# EAGLE design bmp_co_spg (EAGLE 9.6.2)
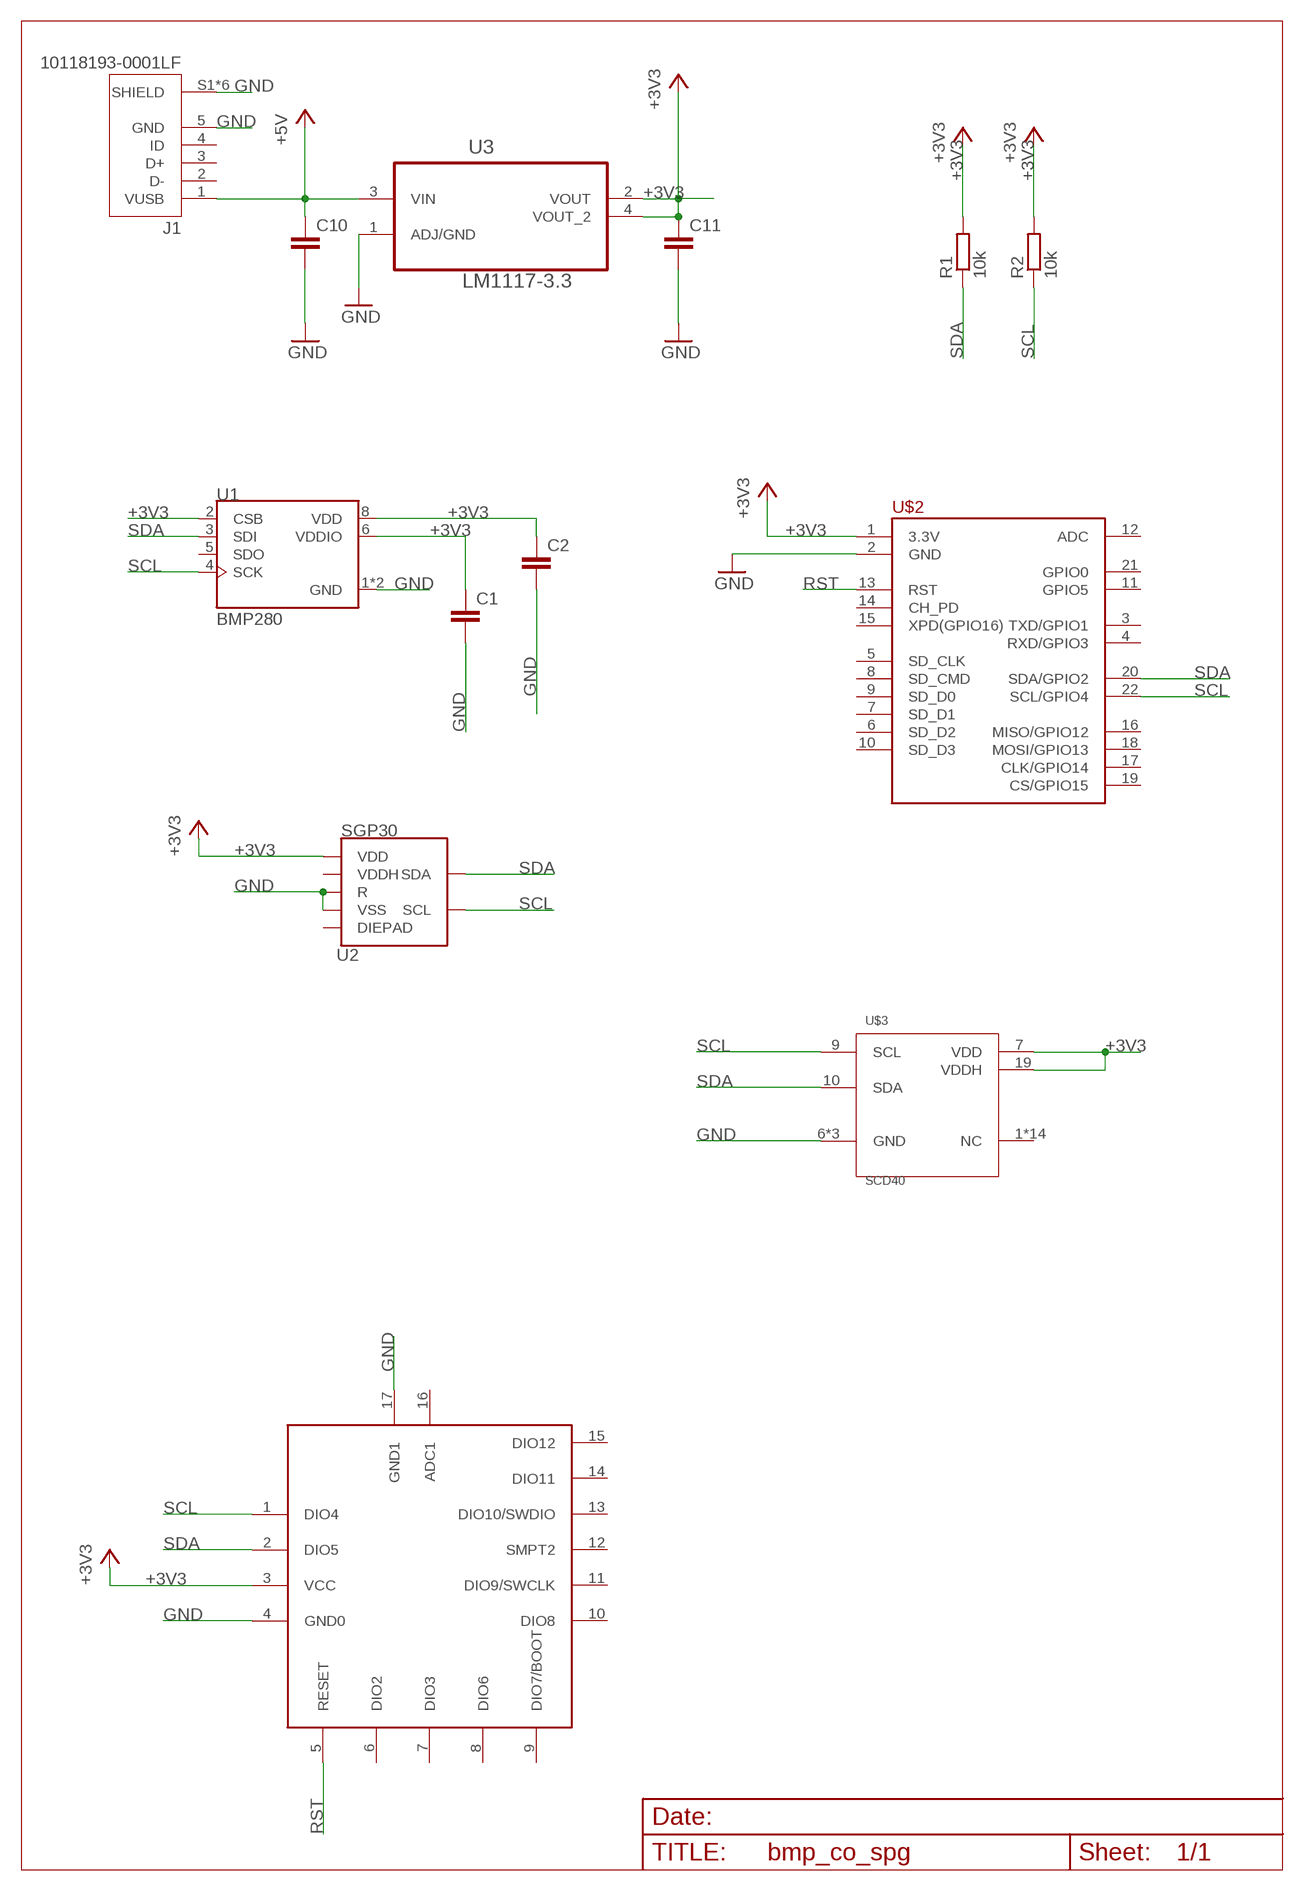
[diagram p0: schematic, sheet 1]

## Parts
C1  100nF  C-EUC1206  [C1206]
C2  100nF  C-EUC1206  [C1206]
C10  47u  C-EUC1206  [C1206]
C11  10u  C-EUC1206  [C1206]
J1  10118193-0001LF  [FCI_10118193-0001LF]
R1  10k  R-EU_R0402  [R0402]
R2  10k  R-EU_R0402  [R0402]
U1  BMP280  [XDCR_BMP280]
U2  SGP30  [SGP30]
U3  LM1117-3.3  [SOT230]
U$1  BLUENRG-234BLEMODULE  [BLUENRG-234BLEMODULE]
U$2  OLIMEX_MOD-WIFI-ESP8266-DEV>PINS-OUTSIDE  [OLIMEX_MOD-WIFI-ESP8266-DEV-PINS-OUTSIDE]
U$3  SCD40  [SCD4X]

## Nets
+3V3 [supply]: C1.1 C2.1 C11.1 R1.2 R2.2 U1.2(CSB) U1.6(VDDIO) U1.8(VDD) U2.1(VDD) U3.2(VOUT) U3.4(VOUT_2) U$1.3(VCC) U$2.1(3.3V) U$3.7(VDD) U$3.19(VDDH)
+5V [supply]: C10.1 J1.1(VUSB) U3.3(VIN)
GND: C1.2 C2.2 C10.2 C11.2 J1.5(GND) J1.S1(SHIELD) J1.S2(SHIELD) J1.S3(SHIELD) J1.S4(SHIELD) J1.S5(SHIELD) J1.S6(SHIELD) U1.1(GND) U1.7(GND) U2.2(VSS) U2.4(R) U3.1(ADJ/GND) U$1.4(GND0) U$1.17(GND1) U$2.2(GND) U$3.6(GND) U$3.20(GND) U$3.21(GND)
RST: U$1.5(RESET) U$2.13(RST)
SCL: R2.1 U1.4(SCK) U2.6(SCL) U$1.1(DIO4) U$2.22(SCL/GPIO4) U$3.9(SCL)
SDA: R1.1 U1.3(SDI) U2.3(SDA) U$1.2(DIO5) U$2.20(SDA/GPIO2) U$3.10(SDA)
Unconnected: J1.2(D-) J1.3(D+) J1.4(ID) U1.5(SDO) U2.5(VDDH) U2.DIEPAD U$1.6(DIO2) U$1.7(DIO3) U$1.8(DIO6) U$1.9(DIO7/BOOT) U$1.10(DIO8) U$1.11(DIO9/SWCLK) U$1.12(SMPT2) U$1.13(DIO10/SWDIO) U$1.14(DIO11) U$1.15(DIO12) U$1.16(ADC1) U$2.3(TXD/GPIO1) U$2.4(RXD/GPIO3) U$2.5(SD_CLK) U$2.6(SD_D2) U$2.7(SD_D1) U$2.8(SD_CMD) U$2.9(SD_D0) U$2.10(SD_D3) U$2.11(GPIO5) U$2.12(ADC) U$2.14(CH_PD) U$2.15(XPD(GPIO16)) U$2.16(MISO/GPIO12) U$2.17(CLK/GPIO14) U$2.18(MOSI/GPIO13) U$2.19(CS/GPIO15) U$2.21(GPIO0) U$3.1(NC) U$3.2(NC) U$3.3(NC) U$3.4(NC) U$3.5(NC) U$3.8(NC) U$3.11(NC) U$3.12(NC) U$3.13(NC) U$3.14(NC) U$3.15(NC) U$3.16(NC) U$3.17(NC) U$3.18(NC)

## Library data of the parts
C1 C2 C10 C11 = rcl:C-EU: CAPACITOR, European symbol; SPICEPREFIX: C
J1 = micro_usb:10118193-0001LF: Micro USB B Type Receptacle Check availability <https://pricing.snapeda.com/parts/10118193-0001LF/FCI/view-part?ref=eda>; AVAILABILITY: In Stock; DESCRIPTION: USB - micro B USB 2.0 Receptacle Connector 5 Position Surface Mount, Right Angle; Through Hole; MF: FCI; MP: 10118193-0001LF; PACKAGE: None; PRICE: None
R1 R2 = rcl:R-EU_: RESISTOR, European symbol; SPICEPREFIX: R
U1 = BMP280:BMP280: BMP280 Absolute Barometric Pressure Sensor for Battery Powered Devices 2 x 2.5mm Check availability <https://pricing.snapeda.com/parts/BMP280/Bosch/view-part?ref=eda>; AVAILABILITY: In Stock; DESCRIPTION: Pressure Sensor 4.35PSI ~ 15.95PSI (30kPa ~ 110kPa) Absolute - 16b 8-SMD; MF: Bosch; MP: BMP280; PACKAGE: LGA-8 Bosch Tools; PRICE: None; PURCHASE-URL: https://pricing.snapeda.com/search/part/BMP280/?ref=eda
U2 = SGP30:SGP30: The SGP30 is a digital multi-pixel gas sensor designed for easy integration into air purifier, demand-controlled ventilation, and IoT applications. Check availability <https://pricing.snapeda.com/parts/SGP30/Sensirion%20AG/view-part?ref=eda>; AVAILABILITY: In Stock; DESCRIPTION: SGP30, SHTC1 Air Quality, Humidity, Temperature Sensor Arduino Platform Evaluation Expansion Board; MF: Sensirion AG; MP: SGP30; PACKAGE: None; PRICE: None
U3 = LM1117-3.3:LM1117-3.3: IC REG LDO 800MA 3.3V Check prices <https://pricing.snapeda.com/parts/LM1117-3.3/Texas%20Instruments/view-part?ref=eda>; AVAILABILITY: In Stock; DESCRIPTION: Linear Voltage Regulator IC Positive Fixed 1 Output 800mA DDPAK/TO-263-3; MF: Texas Instruments; MP: LM1117-3.3; PACKAGE: None; PRICE: None
U$1 = BLUENRG-234blemodule:BLUENRG-234BLEMODULE: BLUENRG-234 BLE Module
U$2 = esp8266modules:OLIMEX_MOD-WIFI-ESP8266-DEV: Olimex MOD-WIFI-ESP8266-DEV is an development board for ESP8266 with all GPIOs and resources exposed. It can be soldered to PCB or used with breadboard. Small U.FL connector is provided for external antenna connection.
U$3 = SCD40-D-R1:SCD40

## Net classes
0 default: width 0.254 mm, clearance 0.203 mm
1 supply: width 0.406 mm, clearance 0.203 mm

## Board
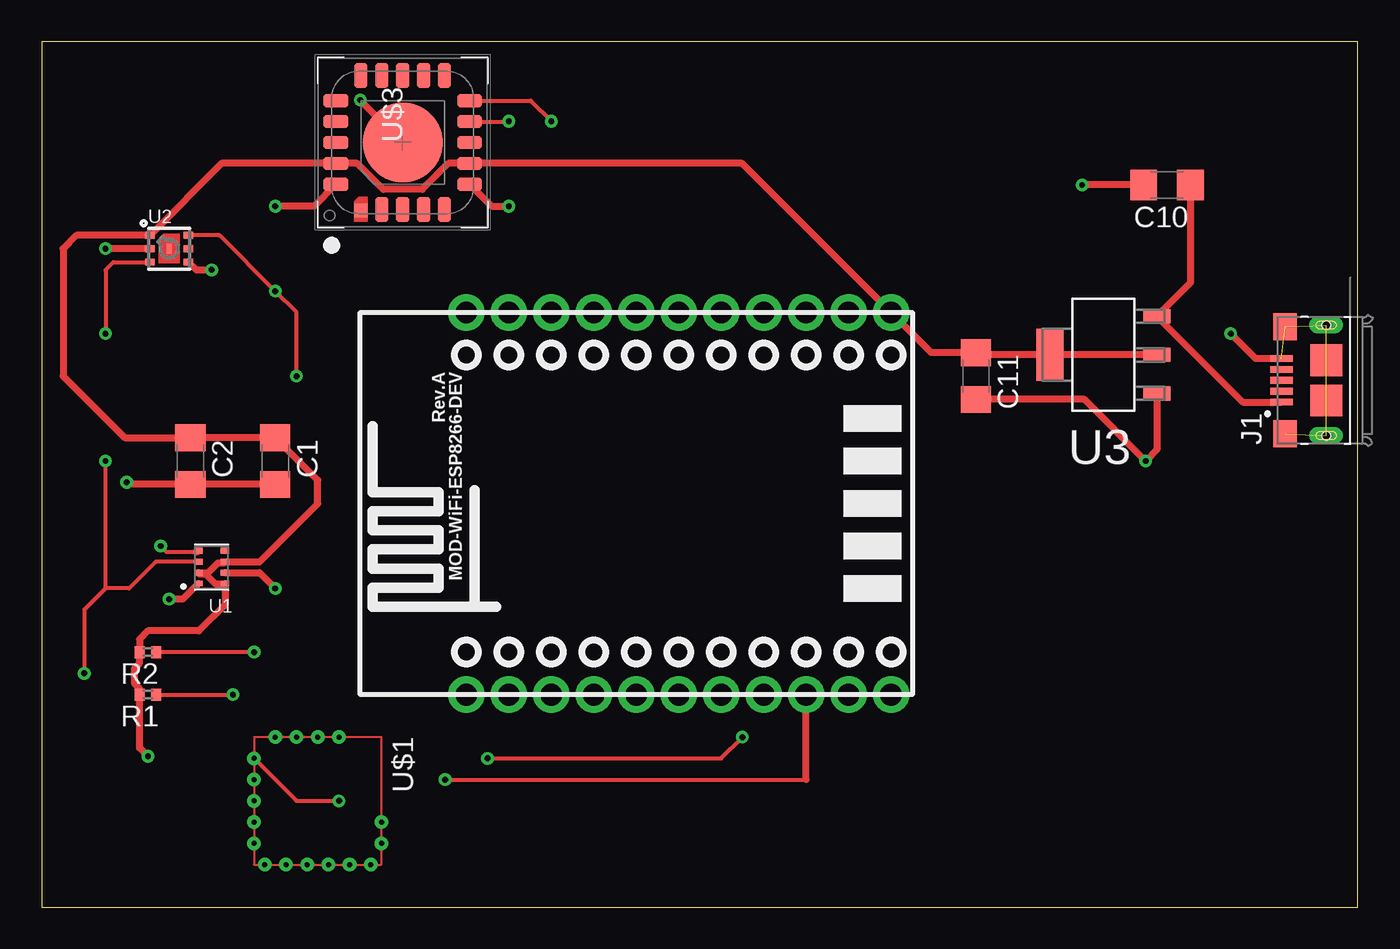
[diagram p1: board, top side]
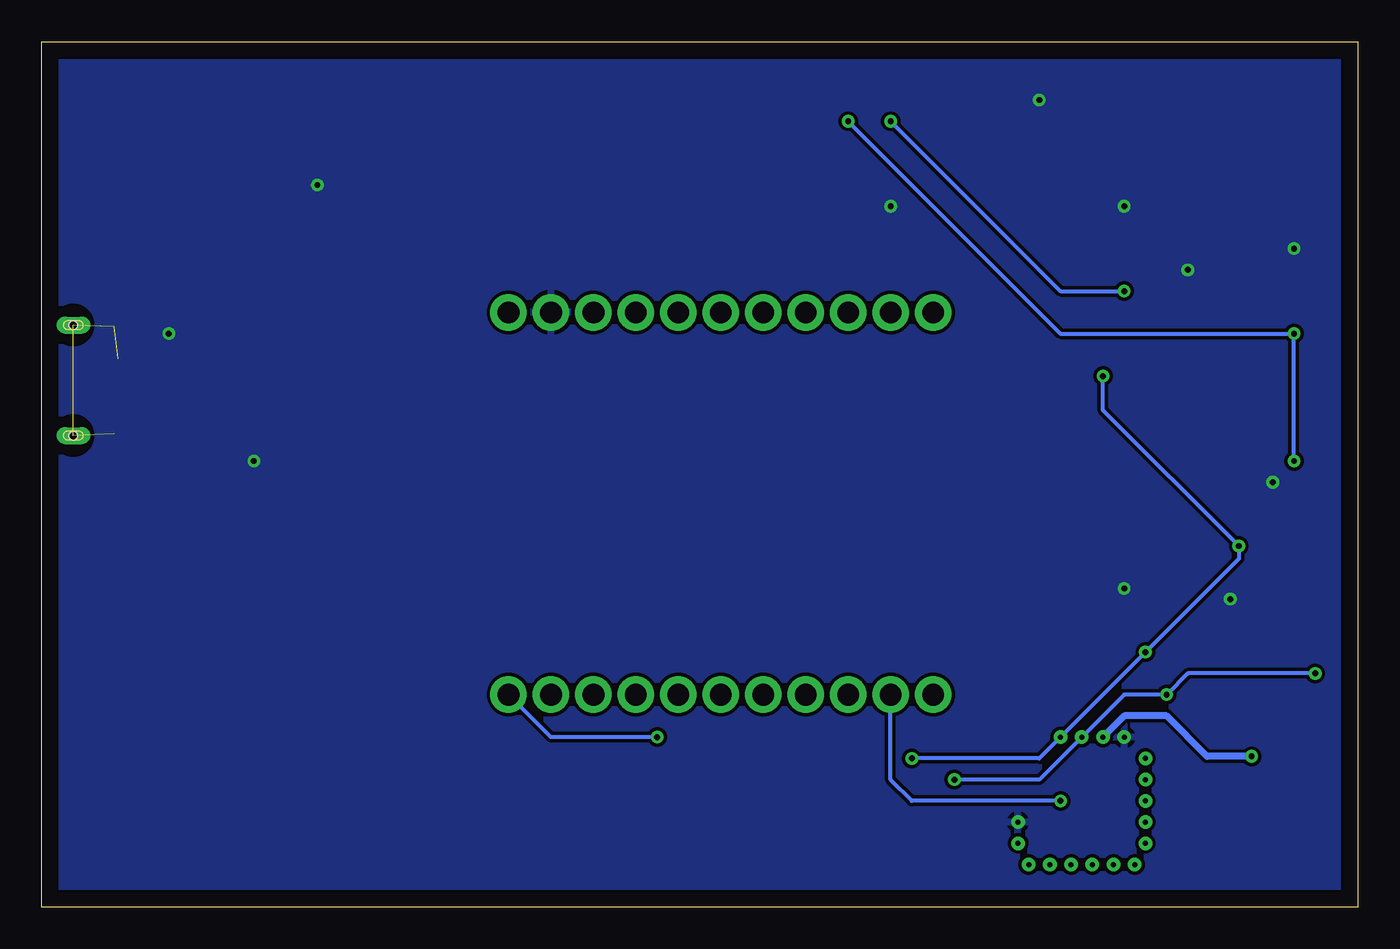
[diagram p2: board, bottom side, seen from below]

Size 78.72 x 51.74 mm. Coordinates in mm from the lower left corner, seen from the top.
Outline: 0,0 78.72,0 78.72,51.74 0,51.74 0,0
Copper layers (1*16): Top 0.035mm / dielectric 1.5mm / Bottom 0.035mm
Design rules "default": minimum track width 6mil, minimum drill 0.35mm, track to track 6mil, track to pad 6mil, pad to pad 6mil, via to via 6mil, smd to smd 6mil, copper to edge 40mil, drill to drill 6mil, minimum pad ring 10mil, minimum via ring 8mil, stop-mask expansion 4mil, vias tented up to drill 0mil, thermal gap 10mil

### Footprints (pad centres in the part's own frame; a part is rotated, then mirrored left to right if it is on the bottom)
C1206 = smd 1.6 x 1.8: 1 -1.4,0; 2 1.4,0
FCI_10118193-0001LF = smd 0.4 x 1.35: 1 -1.3,2.675; 2 -0.65,2.675; 3 0,2.675; 4 0.65,2.675; 5 1.3,2.675 | smd 1.6 x 1.4: S1 -3.2,2.45; S2 3.2,2.45 | smd 1.9 x 1.9: S3 1.2,0; S4 -1.2,0 | drill 0.5 pad 0.9 long: S5 -3.3,0; S6 3.3,0 | hole 0.5: -3.3,0; 3.3,0
R0402 = smd 0.6 x 0.7: 1 -0.5,0; 2 0.5,0
XDCR_BMP280 = smd 0.5 x 0.35: 1 0.8,0.975; 2 0.8,0.325; 3 0.8,-0.325; 4 0.8,-0.975; 5 -0.8,-0.975; 6 -0.8,-0.325; 7 -0.8,0.325; 8 -0.8,0.975
SGP30 = smd 0.55 x 0.4: 1 -1.15,0.8; 2 -1.15,0; 3 -1.15,-0.8; 4 1.15,-0.8; 5 1.15,0; 6 1.15,0.8 | smd 0.305 x 0.61: DIEPAD 0,0
SOT230 = smd 1.6 x 0.838: 1 -3.2,2.311; 2 -3.2,0; 3 -3.2,-2.311 | smd 1.6 x 3.099: 4 3.2,0
BLUENRG-234BLEMODULE = drill 0.3 pad 0.813: 1 -3.81,1.27 | drill 0.3: 2 -3.81,0; 3 -3.81,-1.27; 4 -3.81,-2.54; 5 -2.54,-3.81; 6 -1.27,-3.81; 7 0,-3.81; 8 1.27,-3.81; 9 2.54,-3.81; 10 3.81,-3.175; 11 3.81,-1.905; 12 3.81,-0.635; 13 3.81,0.635; 14 3.81,1.905; 15 3.81,3.175; 16 2.54,3.81; 17 1.27,3.81
OLIMEX_MOD-WIFI-ESP8266-DEV-PINS-OUTSIDE = drill 1.3 pad 2.184: 1 0,0; 2 0,-2.54; 3 0,-5.08; 4 0,-7.62; 5 0,-10.16; 6 0,-12.7; 7 0,-15.24; 8 0,-17.78; 9 0,-20.32; 10 0,-22.86; 11 0,-25.4; 12 22.86,-25.4; 13 22.86,-22.86; 14 22.86,-20.32; 15 22.86,-17.78; 16 22.86,-15.24; 17 22.86,-12.7; 18 22.86,-10.16; 19 22.86,-7.62; 20 22.86,-5.08; 21 22.86,-2.54; 22 22.86,0
SCD4X = smd 0.8 x 0.8: 1 -4.075,2.5 | smd 1.5 x 0.8: 2 -4,1.25; 3 -4,0; 4 -4,-1.25; 5 -4,-2.5; 11 4,-2.5; 12 4,-1.25; 13 4,0; 14 4,1.25; 15 4,2.5 | smd 0.8 x 1.5: 6 -2.5,-4; 7 -1.25,-4; 8 0,-4; 9 1.25,-4; 10 2.5,-4; 16 2.5,4; 17 1.25,4; 18 0,4; 19 -1.25,4; 20 -2.5,4 | smd 4.8 x 4.8: 21 0,0

### Placement (x,y rotation side)
C1  13.97,26.67 270 top
C2  8.89,26.67 270 top
C10  67.31,43.18 180 top
C11  55.88,31.75 270 top
J1  76.83,31.5 90 top
R1  6.35,12.7 180 top
R2  6.35,15.24 180 top
U1  10.16,20.32 180 top
U2  7.62,39.37 0 top
U3  63.5,33.02 180 top
U$1  16.51,6.35 270 top
U$2  50.8,35.56 270 top
U$3  21.59,45.72 90 top

### Tracks (layer width: path | path; a pad name or v marks a point on that pad's centre or on a via)
+3V3  (via drill 0.35)
  Top 0.406: v6.35,9.01 5.85,9.51 R1.2 5.85,13.06 5.57,13.35 5.57,14.29 5.85,14.58 R2.2 5.85,16.01 6.35,16.51 9.39,16.51 10.96,18.07 U1.8 10.36,19.34 9.78,19.93 9.43,19.93 U1.2 9.96,20 10.54,20.58 10.89,20.58 U1.6 13.03,20.64 16.51,24.13 16.51,25.53 C1.1 C2.1 | 9.5,28.68 C2.1 | 66.57,33.15 U3.2 U3.4 56.01,33.02 C11.1 53.21,33.15 U$2.1 41.89,44.47 U$3.7 24.31,44.47 22.75,42.91 20.43,42.91 18.87,44.47 U$3.19 10.77,44.47 U2.1 2.07,40.17 1.27,39.37 1.27,31.75 4.95,28.07 C2.1
  Bottom 0.406: v6.35,9.01 9.01,9.01 11.43,11.43 13.97,11.43 U$1.3
+5V
  Top 0.406: C10.1 68.71,37.34 U3.3 71.84,30.2 J1.1
GND  (via drill 0.35)  (6 unrouted)
  Top 0.406: U1.1 8.43,18.41 v7.62,18.41 | U1.7 13.03,20 v13.97,19.05 | C1.2 C2.2 5.21,25.27 v5.08,25.4 | C10.2 v62.23,43.18 | U3.1 66.7,27.33 v66.04,26.67 62.36,30.35 C11.2 | U$3.6 26.9,41.91 v27.94,41.91 | U$3.20 16.28,41.91 v13.97,41.91 | U2.2 v3.81,39.37 | U$3.21 v19.05,48.26 | U2.4 9.24,38.1 v10.16,38.1 | J1.5 72.61,32.8 v71.12,34.29
  pour Bottom: -7.62,54.61 -7.62,-6.35 91.44,-6.35 97.79,0 97.79,56.05
RST  (via drill 0.35)
  Top 0.254: U$1.5 15.24,6.35 v17.78,6.35
  Bottom 0.254: v17.78,6.35 26.67,6.35 27.94,7.62 U$2.13
SCL  (via drill 0.35)
  Top 0.254: v12.7,15.24 R2.1 | 9.29,21.23 7.48,21.23 v7.11,21.59 | U$3.9 27.92,46.97 | U2.6 10.63,40.17 v13.97,36.83 15.24,35.56 v15.24,31.75 | v26.67,8.89 40.64,8.89 v41.91,10.16
  Top 0.406: 9.29,21.23 U1.4 | 27.92,46.97 v27.94,46.99
  Bottom 0.254: v27.94,46.99 17.78,36.83 v13.97,36.83 | v15.24,31.75 15.24,29.72 v7.11,21.59 7.11,20.83 v12.7,15.24 U$1.1 19.05,8.89 v26.67,8.89 | v41.91,10.16 48.26,10.16 U$2.22
SDA  (via drill 0.35)
  Top 0.254: R1.1 v11.43,12.7 | U1.3 6.82,20.64 5.22,19.05 3.81,19.05 | 3.81,19.05 2.54,17.78 v2.54,13.97 | U$3.10 29.25,48.22 v30.48,46.99 | v3.81,34.29 3.81,38.1 4.28,38.57 U2.3 | 3.81,19.05 v3.81,26.67 | v24.13,7.62 45.72,7.62
  Top 0.406: 45.72,7.62 U$2.20
  Bottom 0.254: v2.54,13.97 10.16,13.97 v11.43,12.7 13.97,12.7 U$1.2 19.05,7.62 v24.13,7.62 | v30.48,46.99 17.78,34.29 v3.81,34.29 v3.81,26.67